# EAGLE design emonVS 1.4.2 (EAGLE 9.6.2)
AUTHOR: OpenEnergyMonitor; IGNORE_RENUMBER: F;RV; SOURCE: github.com/openenergymonitor/emonVoltageSense; VERSION: 1.3.2
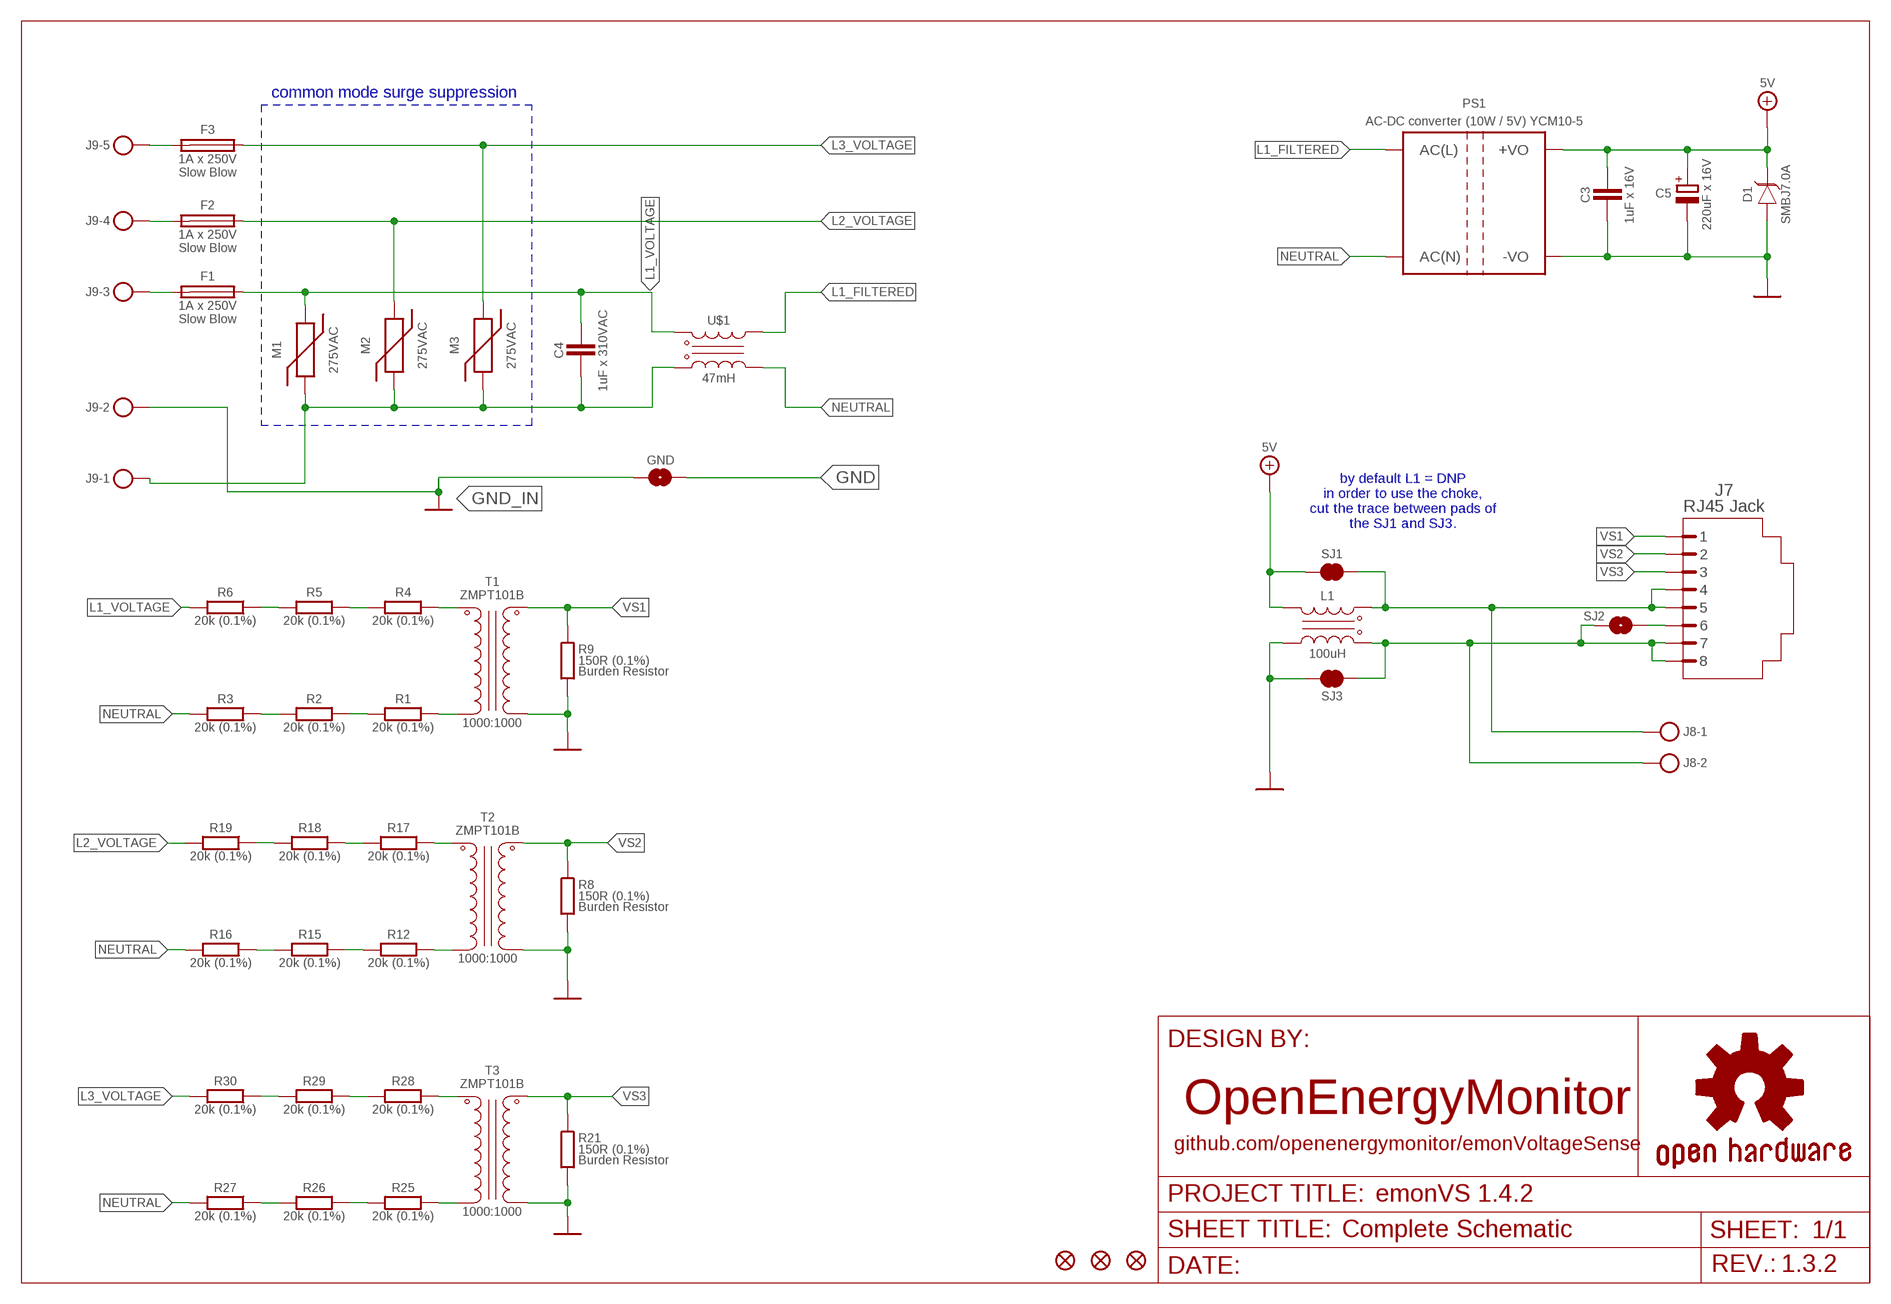
[diagram p0: schematic, sheet 1]

## Parts
C3  1uF x 16V  C_0603  [C0603]
C4  1uF x 310VAC  C_  [C_PTH]
C5  220uF x 16V  CPOL-EU153CLV-0807  [153CLV-0807]
D1  TVS  [DO-214AA]
F1  1A x 250V  FUSE  [FUSE]
F2  1A x 250V  FUSE  [FUSE]
F3  1A x 250V  FUSE  [FUSE]
FD1  FIDUCIAL1X2  [FIDUCIAL]
FD2  FIDUCIAL1X2  [FIDUCIAL]
FD3  FIDUCIAL1X2  [FIDUCIAL]
GND  SOLDER_JUMPER_2P_NO  [SJ_2S-NO]
J7  RJ45 Jack  RJ45-8PPTH  [RJ45-8P]
J8  TERMINAL_BLOCK_2P  [TERMINAL_BLOCK_2P]
J9  TERMINAL_BLOCK_5P  [TERMINAL_BLOCK_5P]
L1  100uH  CHOKES-WE-SL3  [CHOKE_WURTH]
M1  275VAC  MOV_14MM_275VAC  [MOV]
M2  275VAC  MOV_14MM_275VAC  [MOV]
M3  275VAC  MOV_14MM_275VAC  [MOV]
PS1  AC-DC converter (10W / 5V) YCM10-5  MULTICOMP-AC/DC  [MULTICOMP-AC/DC]
R1  20k (0.1%)  R_1206  [R1206]
R2  20k (0.1%)  R_1206  [R1206]
R3  20k (0.1%)  R_1206  [R1206]
R4  20k (0.1%)  R_1206  [R1206]
R5  20k (0.1%)  R_1206  [R1206]
R6  20k (0.1%)  R_1206  [R1206]
R8  150R (0.1%)  R_  [R_PTH_SMD]
R9  150R (0.1%)  R_  [R_PTH_SMD]
R12  20k (0.1%)  R_1206  [R1206]
R15  20k (0.1%)  R_1206  [R1206]
R16  20k (0.1%)  R_1206  [R1206]
R17  20k (0.1%)  R_1206  [R1206]
R18  20k (0.1%)  R_1206  [R1206]
R19  20k (0.1%)  R_1206  [R1206]
R21  150R (0.1%)  R_  [R_PTH_SMD]
R25  20k (0.1%)  R_1206  [R1206]
R26  20k (0.1%)  R_1206  [R1206]
R27  20k (0.1%)  R_1206  [R1206]
R28  20k (0.1%)  R_1206  [R1206]
R29  20k (0.1%)  R_1206  [R1206]
R30  20k (0.1%)  R_1206  [R1206]
SJ1  SOLDER_JUMPER_2P_NC  [SJ_2S-NC]
SJ2  SOLDER_JUMPER_2P_NO  [SJ_2S-NO]
SJ3  SOLDER_JUMPER_2P_NC  [SJ_2S-NC]
T1  ZMPT101B  [ZMPT101B]
T2  ZMPT101B  [ZMPT101B]
T3  ZMPT101B  [ZMPT101B]
U$1  47mH  CHOKES-SCHAFFNER-RN214+RN212  [CHOKE_SCHAFFNER]

## Nets
5.0V: C3.1 C5.+ D1.1(K) L1.6 PS1.+VO PS1.+VO_2(+VO) SJ1.1 ; supply symbol labelled 5V
5VF: J7.4 J7.5 J8.2 L1.1 SJ1.2
GND: C3.2 C5.- D1.2(A) GND.2 L1.4 PS1.-VO PS1.-VO_2(-VO) R8.1A R8.1B R9.1A R9.1B R21.1A R21.1B SJ3.1 T1.4(SEC_1) T2.4(SEC_1) T3.4(SEC_1) ; supply symbol labelled 0V
GND_IN: GND.1 J9.2 ; supply symbol labelled 0V
GNDF: J7.7 J7.8 J8.1 L1.3 SJ2.1 SJ3.2
L1_FILTERED: PS1.AC(L) PS1.AC(L)_2(AC(L)) U$1.4A U$1.4B
L1_VOLTAGE: C4.2A C4.2B F1.OUT M1.1 R6.2 U$1.2A U$1.2B
L2_VOLTAGE: F2.OUT M2.1 R19.2
L3_VOLTAGE: F3.OUT M3.1 R30.2
N$1: R4.1 T1.2(PRI_1)
N$2: R1.1 T1.1(PRI_2)
N$3: R1.2 R2.1
N$4: R4.2 R5.1
N$5: R5.2 R6.1
N$6: R2.2 R3.1
N$7: F1.IN J9.3
N$8: F2.IN J9.4
N$9: J7.6 SJ2.2
N$10: R17.1 T2.2(PRI_1)
N$11: R12.1 T2.1(PRI_2)
N$12: R12.2 R15.1
N$13: R17.2 R18.1
N$14: R18.2 R19.1
N$15: R15.2 R16.1
N$16: F3.IN J9.5
N$17: C4.1A C4.1B J9.1 M1.2 M2.2 M3.2 U$1.1A U$1.1B
N$18: R28.1 T3.2(PRI_1)
N$19: R25.1 T3.1(PRI_2)
N$21: R25.2 R26.1
N$22: R28.2 R29.1
N$23: R29.2 R30.1
N$24: R26.2 R27.1
NEUTRAL: PS1.AC(N) PS1.AC(N)_2(AC(N)) R3.2 R16.2 R27.2 U$1.3A U$1.3B
VS1: J7.1 R9.2A R9.2B T1.3(SEC_2)
VS2: J7.2 R8.2A R8.2B T2.3(SEC_2)
VS3: J7.3 R21.2A R21.2B T3.3(SEC_2)

## Notes on the sheet
- common mode surge suppression
- by default L1 = DNP
  in order to use the choke,
  cut the trace between pads of
  the SJ1 and SJ3.

## Library data of the parts
C3 = My-RLC:C_: NON-POLARIZED CAP; PN: GCM188R71C105KA64D
C4 = OpenEnergyMonitor:C_: NON-POLARIZED CAP; PN: B32923C3105M000; PN1: B32923C3105M; PN2: DE2F3KY103MA3BM02F
C5 = rcl:CPOL-EU: POLARIZED CAPACITOR, European symbol; PN: 6SVPE180M; SPICEPREFIX: C
D1 = My-Diodes:TVS; FAMILY: SMBJ7.0A; PN: SMBJ7.0A
F1-F3 = OpenEnergyMonitor:FUSE; FAMILY: Slow Blow; PN: MST 1A 250V
FD1-FD3 = OpenEnergyMonitor:FIDUCIAL: Fiducial Alignment Points Point-of-reference for pick-and-place machines and other optical instruments.
GND SJ2 = OpenEnergyMonitor:SOLDER_JUMPER_2P_NO: Solder Jumper Standard SMD solder jumper. Used to automate production. Two varients : Normally Open and Normally Closed are the same, but have different paste layers. NC will have a large amount of paste and should jumper during reflow.
J7 = OpenEnergyMonitor:RJ45-8P: RJ45 Jack Simple RJ45, 8-pin connection - connector for common Cat5, Cat5e, and Cat6 Ethernet cables. Footprint not yet proven in production. Connector sku is PRT-00643; Breakout PCB sku is BOB-00716.; PN: PRT-00643
J8 = OpenEnergyMonitor:TERMINAL_BLOCK_2P: TE Connectivity - Fixed Terminal Blocks Number of Positions: 2 Position Pitch: 5 mm Connection Method: Screw Clamp Current Rating: 13.5 A Voltage Rating: 300 V Wire Gauge Min: 30 AWG Wire Gauge Max: 16 AWG; PN: 282836-2
J9 = OpenEnergyMonitor:TERMINAL_BLOCK_5P: TE Connectivity - Fixed Terminal Blocks Number of Positions: 5 Position Pitch: 5 mm Connection Method: Screw Clamp Current Rating: 13.5 A Voltage Rating: 300 V Wire Gauge Min: 30 AWG Wire Gauge Max: 16 AWG; PN: 282836-5
L1 = OpenEnergyMonitor:CHOKES: Schaffner Common Mode Chokes RN series Current-compensated Chokes; PN: 744252101
M1-M3 = OpenEnergyMonitor:MOV_: MOV - Metal-Oxide Varistor; PN: MOV-14D431KTR
PS1 = OpenEnergyMonitor:MULTICOMP-AC/DC: Multicomp PRO - AC to DC Converter Module This device supports 5W module (MP-LD05-23B05R2) (square footprint) and 10W module (MP-LD10-23B05R2) (rectangle footprint).; PN: MP-LD10-23B05R2
R1-R6 R12 R15-R19 R25-R30 = My-RLC:R_: RESISTOR; PN: ERJ-H3GJ103V
R8 R9 R21 = OpenEnergyMonitor:R_: Burden Resistors This footprint supports SMD 0603 package and PTH 0204 package.; DESCRIPTION: Burden Resistor; PN: ERJ-H3EF75R0V; VALUE: 75R (1%)
SJ1 SJ3 = OpenEnergyMonitor:SOLDER_JUMPER_2P_NC: Solder Jumper Standard SMD solder jumper. Used to automate production. Two varients : Normally Open and Normally Closed are the same, but have different paste layers. NC will have a large amount of paste and should jumper during reflow.
T1-T3 = OpenEnergyMonitor:ZMPT101B: Current-type Voltage Transformer Source: Datasheet; PN: ZMPT101B; RATIO: 1000:1000
U$1 = OpenEnergyMonitor:CHOKES: Schaffner Common Mode Chokes RN series Current-compensated Chokes; PN: RN214-0.3-02-47M

## Net classes
0 default: clearance 0.205 mm
1 power: width 0.305 mm, drill 0.6 mm, clearance 0.254 mm
2 gnd: width 0.254 mm, drill 0.6 mm, clearance 0.254 mm

## Board
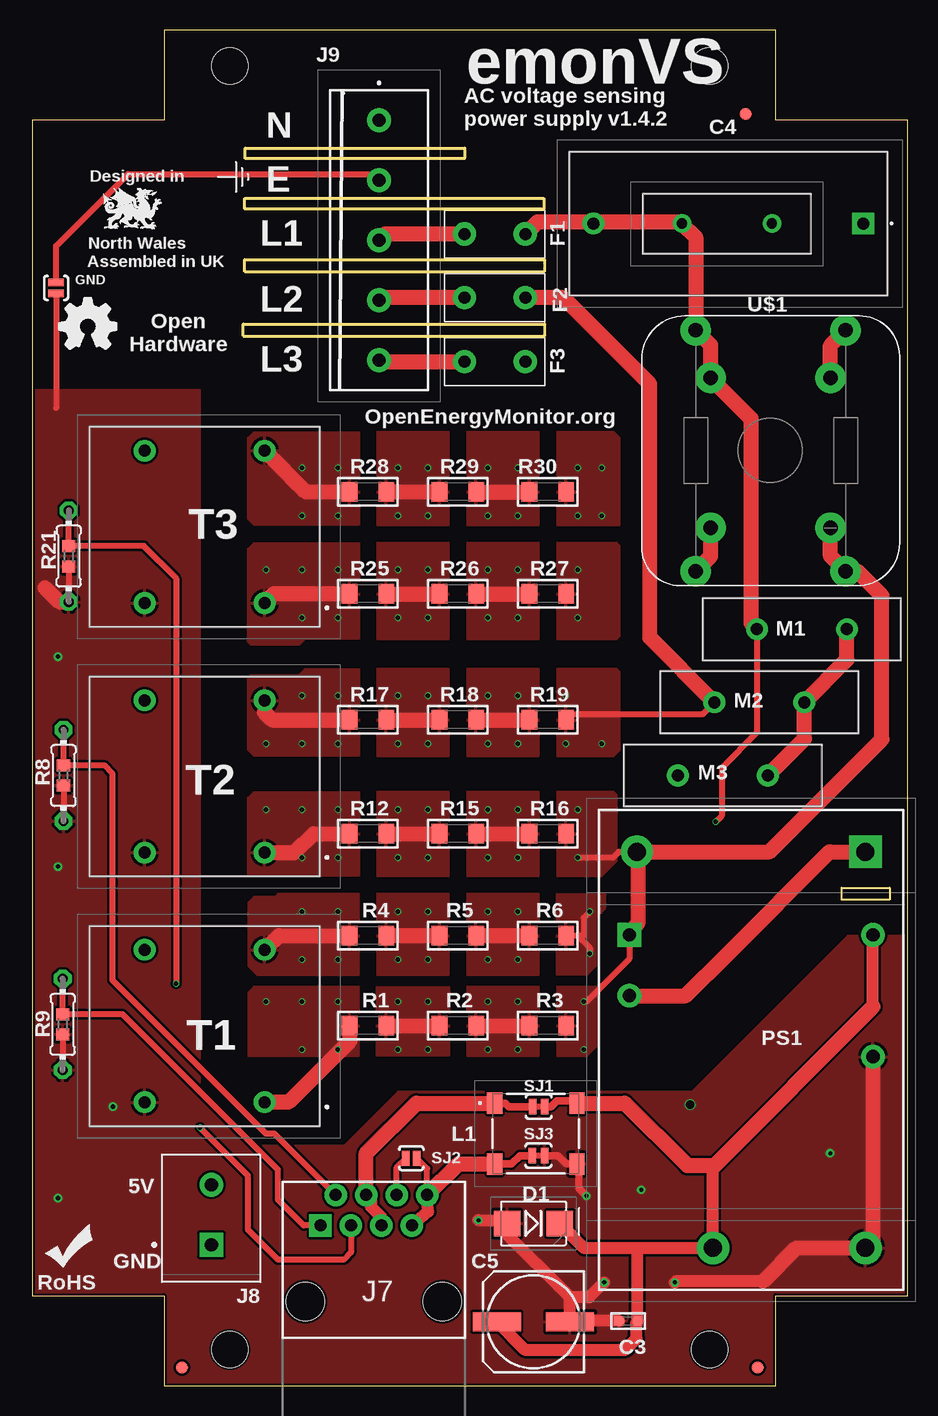
[diagram p1: board, top side]
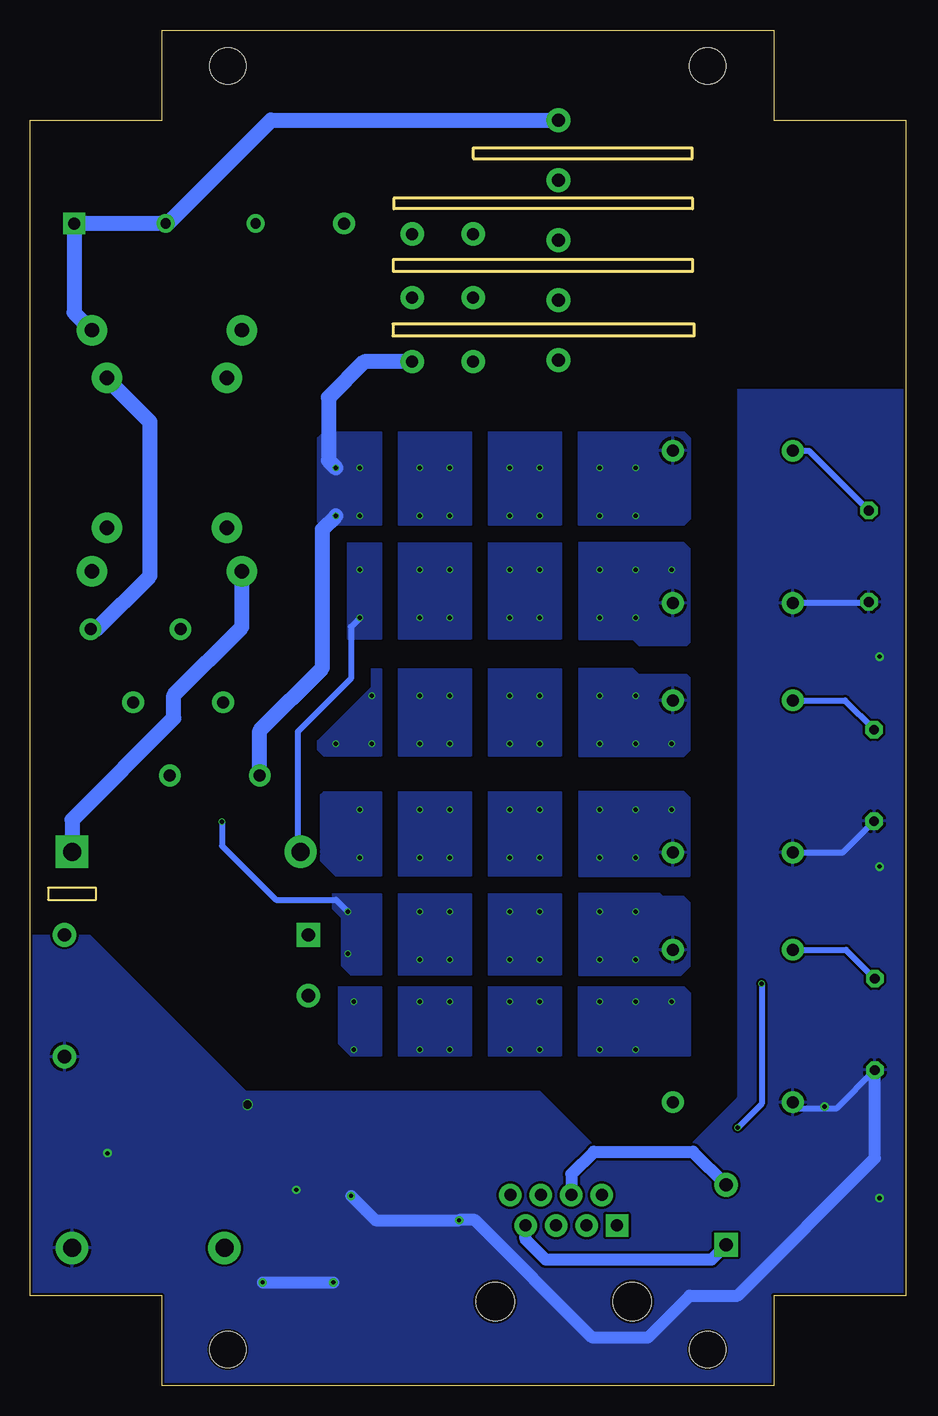
[diagram p2: board, bottom side, seen from below]

Size 73 x 113 mm. Coordinates in mm from the lower left corner, seen from the top.
Outline: 0,7.5 11,7.5 11,0 62,0 62,7.5 73,7.5 73,105.5 62,105.5 62,113 11,113 11,105.5 0,105.5 0,7.5
Copper layers (1*16): Top 0.035mm / dielectric 1.6mm / Bottom 0.035mm
Design rules "jlcpcb-2layers *": minimum track width 5mil, minimum drill 0.3mm, track to track 5mil, track to pad 5mil, pad to pad 5mil, via to via 5mil, smd to smd 5mil, copper to edge 0.2mm, drill to drill 6mil, minimum pad ring 10mil, minimum via ring 3mil, stop-mask expansion 4mil, vias tented up to drill 14mil, thermal gap 10mil
Holes 3 mm at 16.5,3 16.5,110 56.5,3 56.5,110
tKeepout: area 13.5,0 to 19.5,6; area 53.5,0 to 59.5,6; area 53.5,107 to 59.5,113; area 13.5,107 to 19.5,113
Milling: 20 lines

### Footprints (pad centres in the part's own frame; a part is rotated, then mirrored left to right if it is on the bottom)
C0603 = smd 0.8 x 0.8: 1 -0.762,0; 2 0.762,0
C_PTH = drill 1 pad 1.5 square: 1A 0,0 | drill 0.85 pad 1.381: 1B 0,7.62; 2B 0,15.12 | drill 1 pad 1.5: 2A 0,22.5
153CLV-0807 = smd 4 x 1.6: + 3.05,0; - -3.05,0
DO-214AA = smd 2.2 x 2.15: 1 -2.2,0; 2 2.2,0
FUSE = drill 1 pad 1.93: IN 2,1.66; OUT 2,6.74
FIDUCIAL = smd 1 x 1: 1 0,0
SJ_2S-NO = smd 0.635 x 1.27: 1 -0.45,0; 2 0.45,0
RJ45-8P = drill 1 pad 1.88 square: 1 -4.445,6.35 | drill 1 pad 1.88: 2 -3.175,8.89; 3 -1.905,6.35; 4 -0.635,8.89; 5 0.635,6.35; 6 1.905,8.89; 7 3.175,6.35; 8 4.445,8.89 | hole 3.2: -5.715,0; 5.715,0
TERMINAL_BLOCK_2P = drill 1.1 pad 1.6 square: 1 -2.5,0 | drill 1.1 pad 1.6: 2 2.5,0
TERMINAL_BLOCK_5P = drill 1.1 pad 1.65: 1 0,0; 2 5,0; 3 10,0; 4 15,0; 5 20,0
CHOKE_WURTH = smd 1.78 x 1.27: 1 -2.54,-3.43; 3 2.54,-3.43; 4 2.54,3.43; 6 -2.54,3.43
MOV = drill 1 pad 1.5: 1 0,0; 2 7.5,0
MULTICOMP-AC/DC = drill 1.5 pad 2.25: +VO -5.72,-17.526; -VO 6.985,-17.526; AC(N) -12.065,15.494 | drill 1.1 pad 1.65: +VO_2 7.62,8.572; -VO_2 7.62,-1.587; AC(L)_2 -12.7,3.493 | drill 1.5 pad 2.25 square: AC(L) 6.985,15.494 | drill 1.1 pad 1.65 square: AC(N)_2 -12.7,8.572
R1206 = smd 1.3 x 1.6: 1 -1.524,0; 2 1.524,0
R_PTH_SMD = drill 0.813 octagon: 1A -3.81,0; 2A 3.81,0 | smd 1 x 1.1: 1B -0.85,0; 2B 0.85,0
SJ_2S-NC = smd 0.635 x 1.27: 1 -0.508,0; 2 0.508,0
ZMPT101B = drill 1 pad 1.5: 1 0,0; 2 0,-12.7; 3 10,-12.7; 4 10,0
CHOKE_SCHAFFNER = drill 1.2 pad 2.54: 1A -6.332,-9.976; 1B -5.07,-5.993; 2A 6.168,-9.976; 2B 4.93,-5.993; 3A -6.332,10.124; 3B -5.07,6.507; 4A 6.168,10.124; 4B 4.93,6.507

### Placement (x,y rotation side)
C3  49.72,5.38 180 top
C4  69.31,96.87 90 top
C5  41.8,5.31 180 top
D1  41.81,13.5 180 top
F1  34.39,98 270 top
F2  34.39,92.67 270 top
F3  34.39,87.35 270 top
FD1  12.5,1.5 0 top
FD2  60.5,1.5 0 top
FD3  59.5,106 0 top
GND  2,91.5 270 top
J7  28.5,7 0 top
J8  14.95,14.24 90 top
J9  28.93,105.49 270 top
L1  42,21 270 top
M1  60.45,63.05 0 top
M2  56.9,56.95 0 top
M3  53.85,50.86 0 top
PS1  62.5,29 0 top
R1  28,30 0 top
R2  35.5,30 0 top
R3  43,30 0 top
R4  28,37.5 0 top
R5  35.5,37.5 0 top
R6  43,37.5 0 top
R8  2.62,50.85 90 top
R9  2.56,30.1 90 top
R12  28,46 0 top
R15  35.5,46 0 top
R16  43,46 0 top
R17  28,55.5 0 top
R18  35.5,55.5 0 top
R19  43,55.5 0 top
R21  3.06,69.13 90 top
R25  28,66 0 top
R26  35.5,66 0 top
R27  43,66 0 top
R28  28,74.5 0 top
R29  35.5,74.5 0 top
R30  43,74.5 0 top
SJ1  42.25,23.24 180 top
SJ2  31.62,18.95 180 top
SJ3  42.22,19.17 180 top
T1  19.39,23.62 180 top
T2  19.39,44.42 180 top
T3  19.39,65.23 180 top
U$1  61.5,78 180 top

### Tracks (layer width: path | path; a pad name or v marks a point on that pad's centre or on a via)
5.0V
  Top 0.61: SJ1.1 43.26,23.24 43.76,23.74 45.23,23.74 L1.6
  Top 1.016: 70.12,31.57 PS1.+VO_2 | 50.8,11.47 46.04,11.47 D1.1 | 50.8,11.47 50.48,11.16 C3.1 50.4,5.3 50.4,3.9 49.5,3 41.07,3 C5.+ | 50.8,11.47 PS1.+VO 56.78,18.23 56.8,18.24
  Top 1.27: 70.12,31.57 56.8,18.24 56.69,18.34 54.63,18.34 49.43,23.54 L1.6
5VF
  Top 0.61: SJ1.2 40.76,23.24 39.76,23.24 39.46,23.54 L1.1
  Top 1.016: J7.4 28.26,15.49 28.26,14.91 29.14,14.04 J7.5
  Top 1.27: J7.4 27.86,19.36 32.04,23.54 L1.1
  Bottom 1.016: J7.4 27.86,17.64 26,19.5 17.71,19.5 J8.2
GND  (via drill 0.35 pad 0.7, 0.7 pad 0.7)
  Top 0.508: 39.39,13.77 39.66,13.5 | R21.1B R21.1A | R8.1B R8.1A | R9.1B R9.1A | GND.2 2,81.5
  Top 0.61: v46.23,15.8 45.58,16.45 45.58,17.58 | SJ3.1 43.83,19.17 44.54,18.46 L1.4
  Top 1.016: v37.22,13.77 39.39,13.77 | L1.4 | 44.85,5.66 C5.- 44.85,7.35 | 44.85,7.35 39.2,13 | C3.2 45.62,5.38 45.6,5.4 45.8,5.6 | v53.6,8.6 53.69,8.69 60.96,8.69 | v47.7,8.6 46.45,7.35 44.85,7.35
  Top 1.27: PS1.-VO_2 70.12,12.11 PS1.-VO 63.74,11.47 60.96,8.69 | 1.1,66.5 2.28,65.32 R21.1A
  Bottom 0.508: T3.4 3.15,65.23 R21.1A | R8.1A 5.25,44.42 T2.4 | T1.4 8.89,23.12 5.73,23.12 R9.1A
  Bottom 1.016: v46.23,15.8 44.2,13.77 v37.22,13.77 37.19,13.8 35.9,13.8 26.1,4 21.5,4 18,7.5 14,7.5 2.56,18.94 R9.1A | v53.6,8.6 v47.7,8.6
  other vias: 50.8,16.31 54.86,23.42 66.55,19.36 6.75,23.25 2.16,15.62 2.16,60.76 2.16,43.26
  pour Top: -0.5,83 -0.5,7 10.5,7 10.5,-4.5 62.5,-4.5 62.5,7 73.5,7 74,7.5 74,37.5 68,37.5 55,24.5 30.5,24.5 26,20 18,20 14,24 14,83
  pour Bottom: 14,83 14,24 18,20 26,20 30.5,24.5 55,24.5 68,37.5 74,37.5 74,7.5 73.5,7 62.5,7 62.5,-5 10,-5 10,6.5 -1,6.5 -1,83
GND_IN
  Top 0.508: GND.1 2,95 8,101 28.42,101 J9.2
GNDF
  Top 0.508: J7.8 32.95,18.07 SJ2.1
  Top 0.61: SJ3.2 40.67,19.17 39.96,18.46 L1.3
  Top 1.016: J7.7 33.02,14.5 J7.8
  Top 1.27: J7.8 35.55,18.5 38.53,18.5 L1.3
  Bottom 1.016: J7.7 31.68,12.18 30,10.5 16.17,10.5 14.95,11.72 J8.1
L1_FILTERED
  Top 1.27: U$1.4B 56.57,69.11 U$1.4A | PS1.AC(L) 66.49,44.49 58,36 54.49,32.49 PS1.AC(L)_2
  Bottom 1.27: U$1.4A 55.33,63.24 61.01,57.56 61.01,55.63 69.48,47.16 PS1.AC(L)
L1_VOLTAGE  (via drill 0.35)
  Top 0.508: M1.1 60.45,54.45 57.5,51.5 57.5,47.5 v57,47 | v46.5,39.5 46,39 46,37.5 45.5,37.5 | 45.5,37.5 R6.2 | 45.5,37.5 46.5,36.5 v46.5,36
  Top 1.27: M1.1 59.95,63.55 59.95,80.61 U$1.2B 56.57,86.74 U$1.2A 55.33,95.73 C4.2B 54.07,97 46.94,97 C4.2A 46.69,97 42.13,97 F1.OUT
  Bottom 0.508: v57,47 57,45 52.5,40.5 47.5,40.5 v46.5,39.5
  pour Bottom: 43.75,41 43.75,34.25 46.25,34.25 47,35 47,39 47.75,39.75 47.75,41
  pour Top: 43.75,41 47.75,41 47.75,39.75 47,39 47,35 46.25,34.25 43.75,34.25
L2_VOLTAGE  (via drill 0.35)
  Top 0.508: R19.2 44.98,55.95 55.9,55.95 M2.1
  Top 1.27: F2.OUT 44.33,90.67 51.5,83.5 51.5,62.35 M2.1
  other vias: 44.5,53.5 44.5,57.5 47.5,53.5
  pour Top: 43.75,59.75 43.75,52.5 48.5,52.5 49,53 49,59.5 48.75,59.75
  pour Bottom: 43.75,52.5 48.5,52.5 49,53 49,53.75 44.5,58.25 44.5,59.75 43.75,59.75
L3_VOLTAGE  (via drill 0.35)
  Bottom 1.27: M3.1 53.85,54.59 48.62,59.82 48.62,71.38 v47.5,72.5 | F3.OUT 45.13,85.35 48.12,82.36 48.12,77.12 v47.5,76.5
  other vias: 45.5,76.5 45.5,72.5
  pour Top: 43.75,79.5 43.75,71.75 49,71.75 49,79 48.5,79.5
  pour Bottom: 43.75,79.5 43.75,71.75 48.75,71.75 49,72 49,79 48.5,79.5
N$1  (via drill 0.35)
  Top 1.27: T1.2 20.57,37.5 R4.1
  other vias: 25.5,39.5 25.5,35.5 22.5,39.5 22.5,35.5
  pour Top: 27.25,41 20.5,41 20.25,40.75 18.5,40.75 18,40.25 18,35 18.75,34.25 27.25,34.25
  pour Bottom: 27.25,41 27.25,34.25 18.75,34.25 18,35 18,40.25 18.5,40.75 20.25,40.75 20.5,41
N$2  (via drill 0.35)
  Top 1.27: R1.1 26.48,28.71 21.39,23.62 T1.1
  other vias: 25.5,32 25.5,28 22.5,28 22.5,32 19.5,32
  pour Top: 27.25,33.25 18.5,33.25 18,32.75 18,27.5 27.25,27.5
  pour Bottom: 18.5,33.25 18,32.75 18,27.5 27.25,27.5 27.25,33.25
N$3  (via drill 0.35)
  Top 1.27: R1.2 R2.1
  other vias: 30.5,32 33,32 33,28 30.5,28
  pour Top: 28.75,33.25 34.75,33.25 34.75,27.5 28.75,27.5
  pour Bottom: 28.75,33.25 28.75,27.5 34.75,27.5 34.75,33.25
N$4  (via drill 0.35)
  Top 1.27: R5.1 R4.2
  other vias: 30.5,39.5 33,39.5 33,35.5 30.5,35.5
  pour Top: 28.75,41 28.75,34.25 34.75,34.25 34.75,41
  pour Bottom: 28.75,41 28.75,34.25 34.75,34.25 34.75,41
N$5  (via drill 0.35)
  Top 1.27: R6.1 R5.2
  other vias: 38,39.5 40.5,39.5 38,35.5 40.5,35.5
  pour Top: 36.25,41 36.25,34.25 42.25,34.25 42.25,41
  pour Bottom: 36.25,41 36.25,34.25 42.25,34.25 42.25,41
N$6  (via drill 0.35)
  Top 1.27: R2.2 R3.1
  other vias: 38,32 40.5,32 40.5,28 38,28
  pour Top: 36.25,33.25 36.25,27.5 42.25,27.5 42.25,33.25
  pour Bottom: 36.25,33.25 36.25,27.5 42.25,27.5 42.25,33.25
N$7
  Top 1.27: F1.IN 29.45,96 J9.3
N$8
  Top 1.27: F2.IN 29.12,90.67 J9.4
N$9
  Top 0.508: J7.6 30.41,18.18 SJ2.2
N$10  (via drill 0.35)
  Top 1.27: T2.2 19.39,56.12 20.01,55.5 R17.1
  other vias: 25.5,57.5 25.5,53.5 22.5,53.5 19.5,53.5 22.5,57.5
  pour Top: 27.25,52.5 18.5,52.5 18,53 18,59 18.25,59.25 22.25,59.25 22.75,59.75 27.25,59.75
  pour Bottom: 27.25,59.75 27.25,52.5 18.5,52.5 18,53 18,59 18.25,59.25 22.25,59.25 22.75,59.75
N$11  (via drill 0.35)
  Top 1.27: T2.1 21.89,44.42 23.47,46 R12.1
  other vias: 25.5,48 25.5,44 22.5,48 22.5,44 19.5,48
  pour Top: 27.25,49.5 27.25,42.5 18,42.5 18,49 18.5,49.5
  pour Bottom: 27.25,49.5 27.25,42.5 18,42.5 18,49 18.5,49.5
N$12  (via drill 0.35)
  Top 1.27: R12.2 R15.1
  other vias: 30.5,48 33,48 33,44 30.5,44
  pour Top: 28.75,49.5 28.75,42.5 34.75,42.5 34.75,49.5
  pour Bottom: 28.75,49.5 28.75,42.5 34.75,42.5 34.75,49.5
N$13  (via drill 0.35)
  Top 1.27: R17.2 R18.1
  other vias: 33,57.5 30.5,57.5 30.5,53.5 33,53.5
  pour Top: 28.75,59.75 28.75,52.5 34.75,52.5 34.75,59.75
  pour Bottom: 28.75,59.75 28.75,52.5 34.75,52.5 34.75,59.75
N$14  (via drill 0.35)
  Top 1.27: R18.2 R19.1
  other vias: 38,57.5 38,53.5 40.5,53.5 40.5,57.5
  pour Top: 36.25,59.75 36.25,52.5 42.25,52.5 42.25,59.75
  pour Bottom: 36.25,59.75 36.25,52.5 42.25,52.5 42.25,59.75
N$15  (via drill 0.35)
  Top 1.27: R15.2 R16.1
  other vias: 38,48 40.5,48 40.5,44 38,44
  pour Top: 36.25,49.5 36.25,42.5 42.25,42.5 42.25,49.5
  pour Bottom: 36.25,49.5 36.25,42.5 42.25,42.5 42.25,49.5
N$16
  Top 1.27: J9.5 29.07,85.35 F3.IN
N$17
  Top 1.27: U$1.1A 66.57,86.71 U$1.1B | M3.2 64.4,53.9 M2.2 67.95,60.51 M1.2
  Bottom 1.27: U$1.1B 66.57,83.9 63,80.33 63,67.5 67.45,63.05 M1.2 | U$1.1A 69.31,89.46 C4.1A C4.1B 61.69,96.69 52.9,105.49 J9.1
N$18  (via drill 0.35)
  Top 1.27: R28.1 22.82,74.5 T3.2
  other vias: 25.5,76.5 22.5,76.5 25.5,72.5 22.5,72.5
  pour Top: 27.25,71.75 18.5,71.75 18,72.25 18,79 18.5,79.5 27.25,79.5
  pour Bottom: 18.5,79.5 18,79 18,72.25 18.5,71.75 27.25,71.75 27.25,79.5
N$19  (via drill 0.35)
  Top 1.27: R25.1 20.16,66 T3.1
  other vias: 25.5,68 25.5,64 22.5,68 19.5,68 22.5,64
  pour Top: 27.25,70.25 27.25,62.25 22.75,62.25 22.25,61.75 18.25,61.75 18,62 18,69.75 18.5,70.25
  pour Bottom: 27.25,70.25 27.25,62.25 22.75,62.25 22.25,61.75 18.25,61.75 18,62 18,69.75 18.5,70.25
N$21  (via drill 0.35)
  Top 1.27: R25.2 R26.1
  other vias: 33,68 30.5,68 30.5,64 33,64
  pour Top: 28.75,62.25 34.75,62.25 34.75,70.25 28.75,70.25
  pour Bottom: 28.75,70.25 28.75,62.25 34.75,62.25 34.75,70.25
N$22  (via drill 0.35)
  Top 1.27: R29.1 R28.2
  other vias: 30.5,76.5 33,76.5 33,72.5 30.5,72.5
  pour Top: 28.75,71.75 34.75,71.75 34.75,79.5 28.75,79.5
  pour Bottom: 28.75,79.5 28.75,71.75 34.75,71.75 34.75,79.5
N$23  (via drill 0.35)
  Top 1.27: R29.2 R30.1
  other vias: 38,76.5 40.5,76.5 38,72.5 40.5,72.5
  pour Top: 36.25,71.75 42.25,71.75 42.25,79.5 36.25,79.5
  pour Bottom: 36.25,79.5 36.25,71.75 42.25,71.75 42.25,79.5
N$24  (via drill 0.35)
  Top 1.27: R26.2 R27.1
  other vias: 38,68 40.5,68 40.5,64 38,64
  pour Top: 36.25,70.25 36.25,62.25 42.25,62.25 42.25,70.25
  pour Bottom: 36.25,70.25 36.25,62.25 42.25,62.25 42.25,70.25
NEUTRAL  (via drill 0.35)
  Top 0.508: PS1.AC(N) 48.92,44.49 48.43,44 v45.5,44 | PS1.AC(N)_2 49.8,35.57 46.23,32 v46,32
  Top 1.27: U$1.3B 66.57,69.14 U$1.3A 68.82,67.88 70.86,65.84 70.86,53.88 61.48,44.49 PS1.AC(N) 50.5,44.43 50.5,38.5 49.8,37.8 PS1.AC(N)_2
  Bottom 0.508: PS1.AC(N) 50.69,44.74 50.69,54.49 46.25,58.93 46.25,63.25 v45.5,64
  other vias: 46,28 45.5,48 45.5,68
  pour Top: 43.75,70.25 43.75,62.25 48.75,62.25 49,62.5 49,70 48.75,70.25
  pour Top: 43.75,49.5 43.75,42.5 47.5,42.5 48.75,43.75 48.75,49.25 48.5,49.5
  pour Top: 43.75,33.25 43.75,27.5 46.25,27.5 47.25,28.5 47.25,33.25
  pour Bottom: 43.75,49.5 43.75,42.5 47.5,42.5 48.75,43.75 48.75,49.25 48.5,49.5
  pour Bottom: 43.75,27.5 46.25,27.5 47.25,28.5 47.25,33.25 43.75,33.25
  pour Bottom: 43.75,70.25 43.75,62.25 46.5,62.25 46.5,70.25
VS1
  Top 0.508: R9.2A R9.2B 3,30.95 3.55,30.95 7.55,30.95 20.5,18 20.5,15.5 22.65,13.35 J7.1
  Bottom 0.508: R9.2A 4.97,36.32 T1.3
VS2
  Top 0.508: R8.2A R8.2B 2.84,51.7 2.85,51.71 6,51.71 6.71,51 6.71,33.78 19.5,21 20.21,21 J7.2
  Bottom 0.508: T2.3 5.06,57.12 2.62,54.69 R8.2A
VS3  (via drill 0.35)
  Top 0.508: R21.2A R21.2B 3.07,69.99 9.31,69.99 12,67.3 v12,33.5 | J7.3 26.59,11.1 26,10.5 20.5,10.5 18,13 18,17.5 v14,21.5
  Bottom 0.508: R21.2A 8.05,77.93 T3.3 | v12,33.5 12,23.5 v14,21.5

### Text on the board
tPlace: emonVS | AC voltage sensing / power supply | v1.4.2 | Designed in | North Wales | Assembled in UK | Open / Hardware | OpenEnergyMonitor.org | RoHS
tNames: N | E | L1 | L2 | L3 | 5V | GND | J7